# EAGLE design Thermostat (EAGLE 9.6.2)
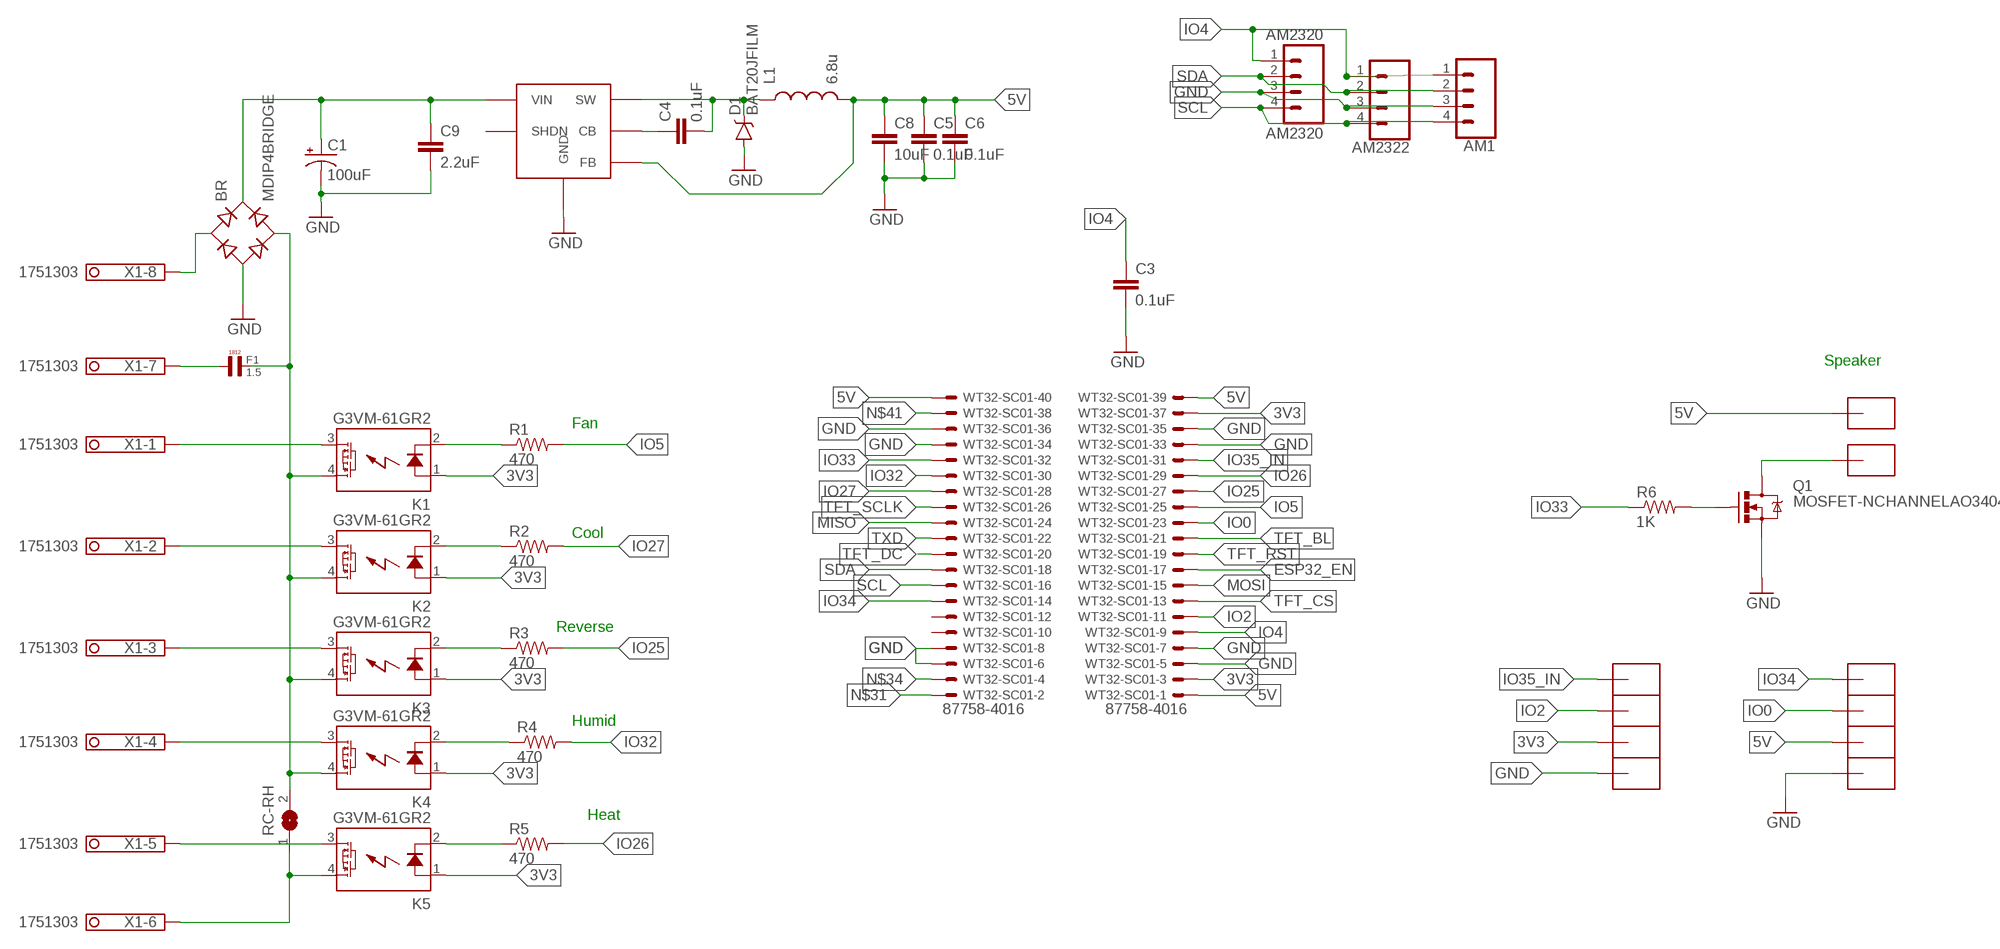
[diagram p0: schematic, sheet 1]

## Parts
AM1  CONN_041.27MM  [1X04_1.27MM]
AM2320  AM2320  M04PTH  [1X04]
AM2322  CONN_041.27MM  [1X04_1.27MM]
BR  MDIP4BRIDGE  [MICRODIP4]
C1  100uF  CAP_POLC  [PANASONIC_C]
C3  0.1uF  CAP0805  [0805]
C4  0.1uF  CAP0805  [0805]
C5  0.1uF  CAP0805  [0805]
C6  0.1uF  CAP0805  [0805]
C8  10uF  CAP0805  [0805]
C9  2.2uF  CAP0805  [0805]
D1  BAT20JFILM  [SOD-323]
F1  1.5  0,1µF  [L4,8]
K1  G3VM-61GR2  AQY22SOP  [SOP04]
K2  G3VM-61GR2  AQY22SOP  [SOP04]
K3  G3VM-61GR2  AQY22SOP  [SOP04]
K4  G3VM-61GR2  AQY22SOP  [SOP04]
K5  G3VM-61GR2  AQY22SOP  [SOP04]
L1  6.8u  INDUCTOR1007  [1007]
Q1  MOSFET-NCHANNELAO3404A  [SOT23-3]
R1  470  RESISTOR0805-RES  [0805]
R2  470  RESISTOR0805-RES  [0805]
R3  470  RESISTOR0805-RES  [0805]
R4  470  RESISTOR0805-RES  [0805]
R5  470  RESISTOR0805-RES  [0805]
R6  1K  RESISTOR0805-RES  [0805]
RC-RH  SJ  [SJ]
U$1  SMD-PAD1SMD-PAD80X32  [SMD-PAD6]
U$2  SMD-PAD1SMD-PAD80X32  [SMD-PAD6]
U$3  SMD-PAD1SMD-PAD80X32  [SMD-PAD6]
U$4  SMD-PAD1SMD-PAD80X32  [SMD-PAD6]
U$5  SMD-PAD1SMD-PAD80X32  [SMD-PAD6]
U$6  SMD-PAD1SMD-PAD80X32  [SMD-PAD6]
U$7  SMD-PAD1SMD-PAD80X32  [SMD-PAD6]
U$9  SMD-PAD1SMD-PAD80X32  [SMD-PAD6]
U$10  SMD-PAD1SMD-PAD80X32  [SMD-PAD6]
U$11  SMD-PAD1SMD-PAD80X32  [SMD-PAD6]
VREG  LMR16006YQ  [SOT-23-6]
WT32-SC01  87758-4016  [87758-4016]
X1  1751303  [1751303]

## Nets
3V3: K1.1(A) K2.1(A) K3.1(A) K4.1(A) K5.1(A) U$1.>PAD WT32-SC01.3 WT32-SC01.37
5V: C5.1 C6.1 C8.1 L1.2 U$5.>PAD U$7.>PAD VREG.3(FB) WT32-SC01.1 WT32-SC01.39 WT32-SC01.40
ESP32_EN: WT32-SC01.17
GND: AM1.3 AM2320.3 AM2322.3 BR.- C1.- C3.2 C5.2 C6.2 C8.2 C9.2 D1.A Q1.2(S) U$2.>PAD U$9.>PAD VREG.2(GND) WT32-SC01.5 WT32-SC01.6 WT32-SC01.7 WT32-SC01.8 WT32-SC01.33 WT32-SC01.34 WT32-SC01.35 WT32-SC01.36
IO0: U$10.>PAD WT32-SC01.23
IO2: U$3.>PAD WT32-SC01.11
IO4: AM1.1 AM2320.1 AM2322.1 C3.1 WT32-SC01.9
IO5: R1.2 WT32-SC01.25
IO25: R3.2 WT32-SC01.27
IO26: R5.2 WT32-SC01.29
IO27: R2.2 WT32-SC01.28
IO32: R4.2 WT32-SC01.30
IO33: R6.1 WT32-SC01.32
IO34: U$6.>PAD WT32-SC01.14
IO35_IN: U$4.>PAD WT32-SC01.31
MISO: WT32-SC01.24
MOSI: WT32-SC01.15
N$2: C4.2 D1.C L1.1 VREG.6(SW)
N$3: BR.AC2 F1.P$2 K1.4(DS1) K2.4(DS1) K3.4(DS1) K4.4(DS1) RC-RH.2
N$4: K4.2(K) R4.1
N$6: Q1.1(G) R6.2
N$7: K3.2(K) R3.1
N$10: K2.2(K) R2.1
N$11: K4.3(DS2) X1.4
N$13: K2.3(DS2) X1.2
N$15: K1.3(DS2) X1.1
N$16: K1.2(K) R1.1
N$17: C4.1 VREG.1(CB)
N$18: K5.3(DS2) X1.5
N$20: BR.AC1 X1.8
N$22: K5.4(DS1) RC-RH.1 X1.6
N$23: F1.P$1 X1.7
N$24: BR.+ C1.+ C9.1 VREG.5(VIN)
N$25: K5.2(K) R5.1
N$29: K3.3(DS2) X1.3
N$31: WT32-SC01.2
N$34: WT32-SC01.4
N$39: Q1.3(D) U$11.>PAD
N$41: WT32-SC01.38
SCL: AM1.4 AM2320.4 AM2322.4 WT32-SC01.16
SDA: AM1.2 AM2320.2 AM2322.2 WT32-SC01.18
TFT_BL: WT32-SC01.21
TFT_CS: WT32-SC01.13
TFT_DC: WT32-SC01.20
TFT_RST: WT32-SC01.19
TFT_SCLK: WT32-SC01.26
TXD: WT32-SC01.22
Unconnected: VREG.4(SHDN) WT32-SC01.10 WT32-SC01.12

## Notes on the sheet
- Speaker
- Fan
- Cool
- Reverse
- Humid
- Heat

## Library data of the parts
AM1 AM2322 = SparkFun-Connectors:CONN_04: Multi connection point. Often used as Generic Header-pin footprint for 0.1 inch spaced/style header connections On any of the 0.1 inch spaced packages, you can populate with these: Break Away Headers - Straight <https://www.sparkfun.com/products/116> (PRT-00116) Break Away Male Headers - Right Angle <https://www.sparkfun.com/products/553> (PRT-00553) Female Headers <https://www.sparkfun.com/products/115> (PRT-00115) Break Away Headers - Machine Pin <https://www.sparkfun.com/products/117> (PRT-00117) Break Away Female Headers - Swiss Machine Pin <https://www.sparkfun.com/products/743> (PRT-00743) For SCREWTERMINALS and SPRING TERMINALS visit here: Screw Terimnals on SparkFun.com <https://www.sparkfun.com/search/results?term=Screw+Terminals> (5mm/3.5mm/2.54mm spacing) This device is also useful as a general connection point to wire up your design to another part of your project. Our various solder wires solder well into these plated through hole pads. Hook-Up Wire - Assortment (Stranded, 22 AWG) <https://www.sparkfun.com/products/11375> (PRT-11375) Hook-Up Wire - Assortment (Solid Core, 22 AWG) <https://www.sparkfun.com/products/11367> (PRT-11367) View the entire wire category on our website here <https://www.sparkfun.com/categories/141> Special notes: Molex polarized connector foot print use with SKU : PRT-08231 with associated crimp pins and housings. 1MM SMD Version SKU: PRT-10208
AM2320 = SparkFun-Connectors:M04: Header 4 Standard 4-pin 0.1" header. Use with straight break away headers (SKU : PRT-00116), right angle break away headers (PRT-00553), swiss pins (PRT-00743), machine pins (PRT-00117), and female headers (PRT-00115). Molex polarized connector foot print use with SKU : PRT-08231 with associated crimp pins and housings. 1MM SMD Version SKU: PRT-10208; PROD_ID: CONN-09696
BR = CuriousTech:MDIP4BRIDGE
C1 = SparkFun-Capacitors:CAP_POL: Capacitor Polarized These are standard SMD and PTH capacitors. Normally 10uF, 47uF, and 100uF in electrolytic and tantalum varieties. Always verify the external diameter of the through hole cap, it varies with capacity, voltage, and manufacturer. The EIA devices should be standard.
C3-C6 C8 C9 = SparkFun-Capacitors:CAP: Capacitor Standard 0603 ceramic capacitor, and 0.1" leaded capacitor.
D1 = SparkFun-DiscreteSemi:BAT20JFILM: 23V, 1A Schottky diode, SOD-323 package; PROD_ID: DIO-11623
F1 = Capacitor-Wima-SMD1812-100v:0,1µF
K1-K5 = relay:AQY*: PhotoMOS Relay NAiS Source: http://www.panasonic-electric-works.com/catalogues/downloads/photomos/ds_x615_en_aqz10_20.pdf; OC_FARNELL: unknown; OC_NEWARK: unknown
L1 = SparkFun-Passives:INDUCTOR: Inductors Basic Inductor/Choke - 0603 and 1206. Footprints are not proven and vary greatly between part numbers. INDUCTOR POWER 3.3UH 4.0A SMD 0.197" L x 0.197" W x 0.177" H (5.00mm x 5.00mm x 4.50mm)
Q1 = SparkFun-DiscreteSemi:MOSFET-NCHANNEL: Common NMOSFET Parts MFG P/N Store ID Prod ID FDD8780 TRANS-09984 SI7820DN TRANS-11055 FDS6630A IC-08089 2N7002PW TRANS-11151 FQP30N06L COM-10213 TRANS-10060 BSS123LT1G TRANS-08345 BSS138 TRANS-00830 BS170 2N7000; PROD_ID: TRAN-12988
R1-R5 = SparkFun-Passives:RESISTOR: Resistor Basic schematic elements and footprints for 0603, 1206, and PTH resistors.
R6 = SparkFun-Resistors:RESISTOR: Resistor Basic schematic elements and footprints for 0603, 1206, and PTH resistors.
RC-RH = jumper:SJ: SMD solder JUMPER
U$1-U$7 U$9-U$11 = CuriousTech:SMD-PAD1: SMD-PAD small
VREG = CuriousTech:LMR16006YQ
WT32-SC01 = con-molex:87758-4016: 40 Pin - 2mm Dual Row Single Wafer, Vertical T/H HDR Source: http://www.molex.com/pdm_docs/sd/877580616_sd.pdf; MF: MOLEX; MPN: 87758-4016; OC_FARNELL: unknown; OC_NEWARK: 25M5691
X1 = con-phoenix-350:1751303: MKDS 1/ 8-3,5 Printklemme Nennstrom: 10 A Bemessungsspannung: 160 V Raster: 3,5 mm Polzahl: 8 Montageart: Löten Anschlussart: Schraubanschluss Anschlussrichtung vom Leiter zur Platine: 0° Source: http://eshop.phoenixcontact.com .. .pdf; OC_FARNELL: unknown; OC_NEWARK: unknown

## Board
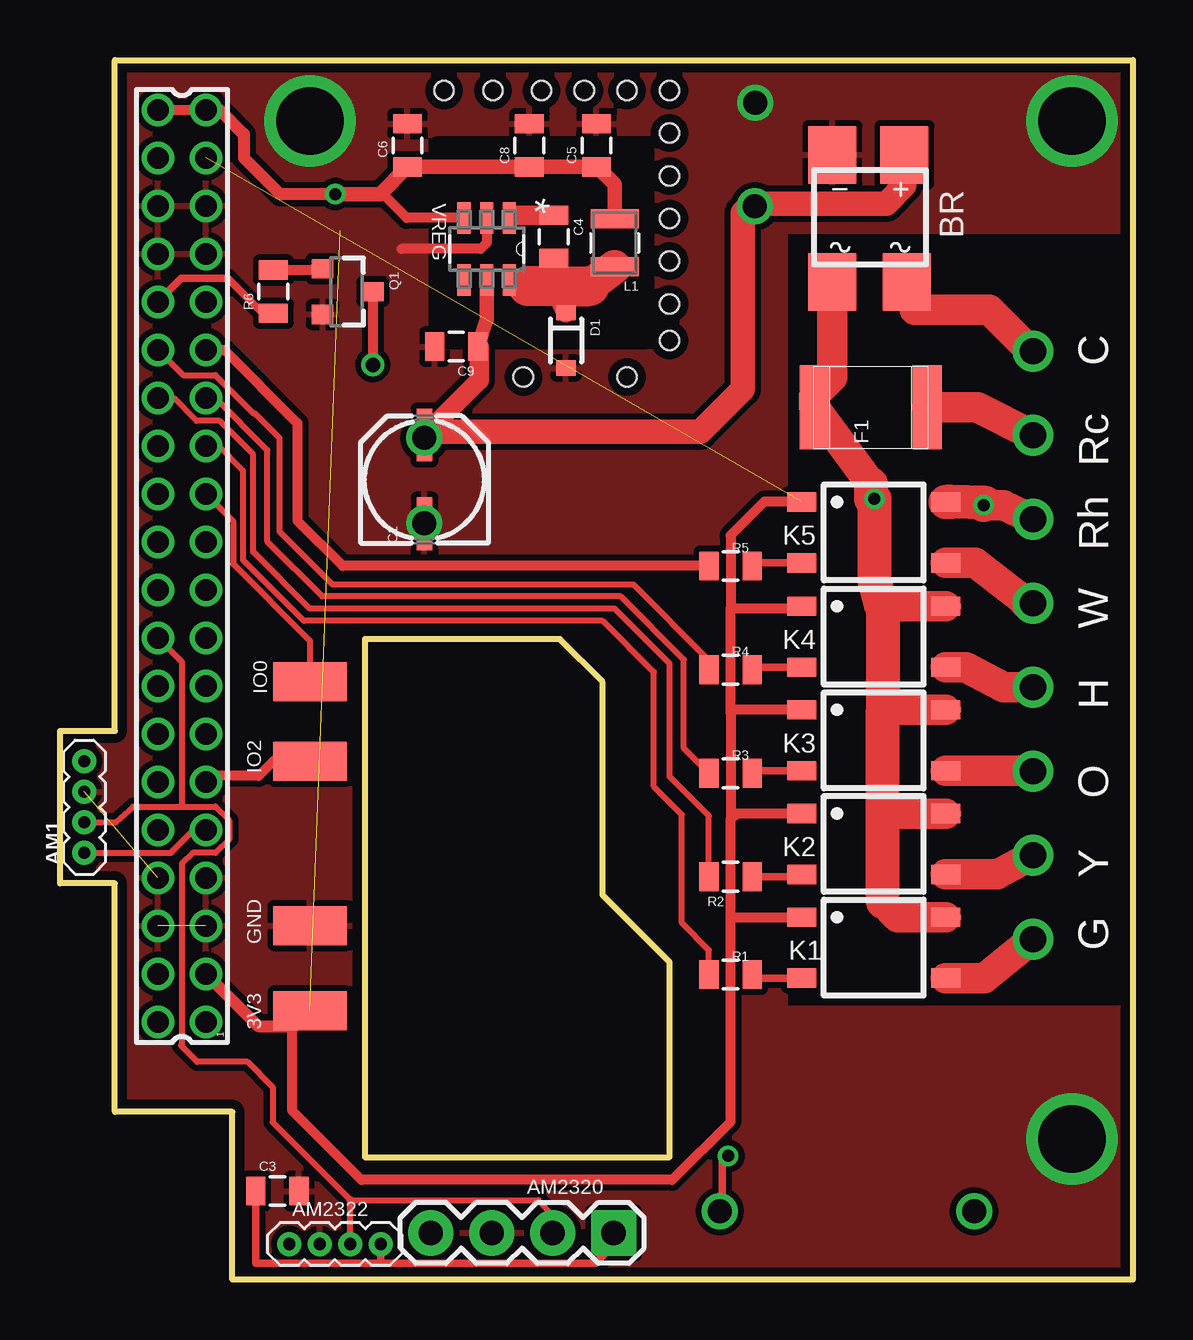
[diagram p1: board, top side]
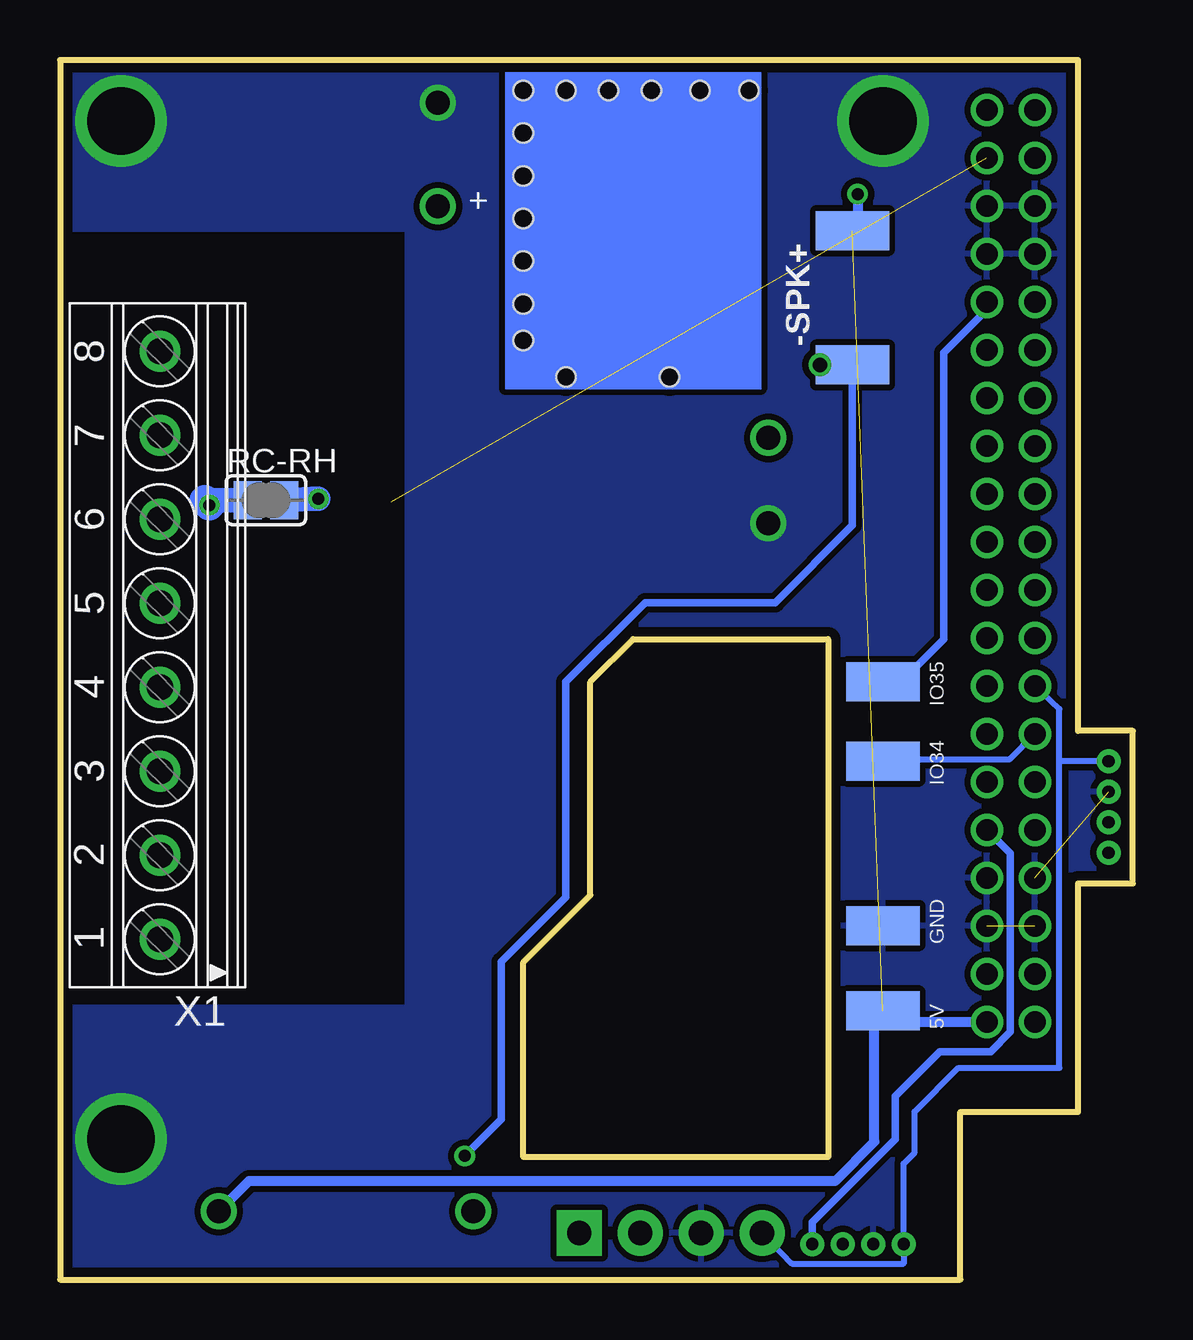
[diagram p2: board, bottom side, seen from below]

Size 44.7 x 50.81 mm. Coordinates in mm from the lower left corner, seen from the top.
Outline: 44.7,0 7.19,0 7.19,6.98 2.29,6.98 2.29,16.51 0,16.51 0,22.86 2.29,22.86 2.29,50.81 44.7,50.81 44.7,0
Outline: 12.7,26.68 12.7,5.1 25.4,5.1 25.4,13.22 22.61,16.02 22.61,24.91 20.83,26.68 12.7,26.68
Copper layers (1*16): Top 0.0356mm / dielectric 1.5011mm / Bottom 0.0356mm
Design rules "LaenPCBOrder": minimum track width 6mil, minimum drill 13mil, track to track 6mil, track to pad 6mil, pad to pad 6mil, via to via 6mil, smd to smd 6mil, copper to edge 15mil, drill to drill 6mil, minimum pad ring 7mil, minimum via ring 7mil, stop-mask expansion 4mil, vias tented up to drill 0mil, thermal gap 10mil
Holes 0.8 mm at 20.07,49.54 21.84,49.54 23.62,49.54 25.4,49.54 25.4,47.77 25.4,45.99 25.4,44.21 25.4,42.43 25.4,40.65 25.4,39.13 23.62,37.61 19.3,37.61 18.03,49.54 16,49.54
tRestrict: area 15.7,39.1 to 24.4,47.3

### Footprints (pad centres in the part's own frame; a part is rotated, then mirrored left to right if it is on the bottom)
1X04_1.27MM = drill 0.508 pad 1: 1 0,0; 2 1.27,0; 3 2.54,0; 4 3.81,0
1X04 = drill 1.016 pad 1.88 square: 1 0,0 | drill 1.016 pad 1.88: 2 2.54,0; 3 5.08,0; 4 7.62,0
MICRODIP4 = smd 2 x 2.4: + -1.4,-2.65; - 1.6,-2.65; AC1 -1.5,2.65; AC2 1.6,2.65
PANASONIC_C = smd 2.2 x 0.65: + 1.9,-0.2; - -1.8,-0.2
0805 = smd 0.8 x 1.2: 1 -0.9,0; 2 0.9,0
SOD-323 = smd 0.63 x 0.83: A 1.15,0; C -1.15,0
L4,8 = smd 3.5 x 1.2: P$1 0,-2.35; P$2 0,2.35
SOP04 = smd 0.8 x 1.2: 1 -1.27,-3; 2 1.27,-3; 3 1.27,3; 4 -1.27,3
1007 = smd 2 x 0.8: 1 0,1; 2 0,-1
SOT23-3 = smd 0.8 x 0.9: 1 -0.95,-1; 2 0.95,-1; 3 0,1.1
SJ = smd 1.168 x 1.6: 1 -0.762,0; 2 0.762,0
SMD-PAD6 = smd 3.048 x 1.626: >PAD 0,0
SOT-23-6 = smd 1.321 x 0.559: 1 -1.295,0.94; 2 -1.295,0; 3 -1.295,-0.94; 4 1.295,-0.94; 5 1.295,0; 6 1.295,0.94
87758-4016 = drill 0.9 pad 1.27: 1 -19,-1; 2 -19,1; 3 -17,-1; 4 -17,1; 5 -15,-1; 6 -15,1; 7 -13,-1; 8 -13,1; 9 -11,-1; 10 -11,1; 11 -9,-1; 12 -9,1; 13 -7,-1; 14 -7,1; 15 -5,-1; 16 -5,1; 17 -3,-1; 18 -3,1; 19 -1,-1; 20 -1,1; 21 1,-1; 22 1,1; 23 3,-1; 24 3,1; 25 5,-1; 26 5,1; 27 7,-1; 28 7,1; 29 9,-1; 30 9,1; 31 11,-1; 32 11,1; 33 13,-1; 34 13,1; 35 15,-1; 36 15,1; 37 17,-1; 38 17,1; 39 19,-1; 40 19,1
1751303 = drill 1.1 pad 1.7: 1 -12.25,-0.1; 2 -8.75,-0.1; 3 -5.25,-0.1; 4 -1.75,-0.1; 5 1.75,-0.1; 6 5.25,-0.1; 7 8.75,-0.1; 8 12.25,-0.1

### Placement (x,y rotation side)
AM1  1.02,17.78 90 top
AM2320  23.07,1.94 180 top
AM2322  13.36,1.48 180 top
BR  33.78,44.21 180 top
C1  14.99,33.29 90 top
C3  9.06,3.69 0 top
C4  20.57,43.45 270 top
C5  22.35,47.26 90 top
C6  14.48,47.26 90 top
C8  19.56,47.26 90 top
C9  16.51,38.88 180 top
D1  21.08,39.13 270 top
F1  33.78,36.34 90 top
K1  33.9,13.83 270 top
K2  33.9,18.15 270 top
K3  33.9,22.47 270 top
K4  33.9,26.78 270 top
K5  33.9,31.13 270 top
L1  23.11,43.19 180 top
Q1  11.94,41.16 270 top
R1  27.94,12.71 180 top
R2  27.94,16.78 180 top
R3  27.94,21.1 180 top
R4  27.94,25.41 180 top
R5  27.94,29.73 180 top
R6  8.89,41.16 90 top
RC-RH  36.12,32.47 0 bottom
U$1  10.41,11.19 0 top
U$2  10.41,14.75 0 bottom
U$3  10.41,21.6 0 top
U$4  10.41,24.91 0 bottom
U$5  11.68,43.7 0 bottom
U$6  10.41,21.6 0 bottom
U$7  10.41,11.19 0 bottom
U$9  10.41,14.75 0 top
U$10  10.41,24.91 0 top
U$11  11.68,38.11 180 bottom
VREG  17.78,42.94 270 top
WT32-SC01  5.08,29.73 90 top
X1  40.64,26.43 90 bottom

### Tracks (layer width: path | path; a pad name or v marks a point on that pad's centre or on a via)
3V3  (1 unrouted)
  Top 0.305: 27.94,15 28,15.06 28,15.1
  Top 0.406: 28,15.1 K1.1 | 27.94,19.2 27.94,15 27.94,6.58 25.51,4.15 12.56,4.15 9.68,7.03 9.68,10.56 9.78,10.56 U$1.>PAD | 27.94,19.2 28.24,19.42 K2.1 | 27.94,23.64 27.94,19.2 | K4.1 30.8,27.95 27.94,27.95 | K5.1 30.89,32.41 29.35,32.41 27.94,31 27.94,27.95 | K3.1 28.04,23.74 27.94,23.64 | 27.94,23.64 27.94,27.95
  Top 0.508: WT32-SC01.3 8.26,10.56 9.78,10.56
5V  (via drill 0.5, 1)  (1 unrouted)
  Top 0.305: C6.1 14.41,46.36 13.37,45.31
  Top 0.406: C5.1 | C5.1 22.37,46.37 | C5.1 | WT32-SC01.40 WT32-SC01.39 | L1.2 23.12,44.19 | VREG.3 14.45,44.23 | 14.44,44.23 14.45,44.23 | 14.45,44.23 13.37,45.31 | C8.1
  Top 0.508: WT32-SC01.39 6.65,48.73 7.66,47.73 7.66,46.75 9.18,45.23 v11.47,45.23
  Top 0.61: 23.12,44.19 23.12,45.63 22.37,46.37 | C5.1 C8.1 C6.1 13.35,45.23 v11.47,45.23
  Bottom 0.305: 10.77,10.83 U$7.>PAD
  Bottom 0.406: 11.94,43.7 U$5.>PAD 11.47,43.92 v11.47,45.23 11.43,45.23 | U$7.>PAD 9.96,10.73 WT32-SC01.1 | 10.77,10.83 10.77,5.75 12.41,4.11 36.83,4.11 v38.09,2.85
GND  (via drill 1, 2.8)  (2 unrouted)
  Top 0.406: 17.78,43.7 VREG.2 17.78,43.19 17.53,42.94 14.22,42.94
  other vias: 15.19,31.51 10.41,48.27 42.16,48.27 42.16,5.86 28.96,49.04
  pour Top (isolate 0.254): 0,1.02 1.02,0 44.7,0 44.7,11.27 30.23,11.27 30.23,43.7 44.7,43.7 44.7,50.81 0,50.81
  pour Bottom (isolate 0.254): 44.7,43.78 30.23,43.78 30.23,11.33 44.7,11.33 44.7,0 0.2,0 0,0.19 0,50.81 44.7,50.81
IO0
  Top 0.254: WT32-SC01.23 7.21,31.6 7.21,29.82 10.41,26.62 U$10.>PAD
IO2
  Top 0.406: U$3.>PAD 8.89,21.6 8.27,20.99 6.33,20.99 WT32-SC01.11
IO4
  Top 0.254: AM1.1 3.68,17.78 3.69,17.78 4.62,17.78 5.57,18.73 WT32-SC01.9
  Top 0.305: AM2320.1 23.07,1.46 22.3,0.69 13.36,0.69 AM2322.1 13.36,0.72 13.32,0.67 8.16,0.67 8.16,3.38 C3.1
  Bottom 0.305: WT32-SC01.9 5.1,17.75 5.1,10.33 5.93,9.5 8.05,9.5 9.91,7.64 9.91,5.84 13.36,2.39 AM2322.1
IO5
  Top 0.254: R1.2 27.04,13.73 25.91,14.86 25.91,19.37 24.74,20.54 24.74,25.31 22.61,27.45 10.16,27.45 7.62,29.99 7.62,33.7 6.59,34.73 WT32-SC01.25
IO25
  Top 0.254: R3.2 26,22.14 26,25.83 23.37,28.46 10.92,28.46 8.64,30.75 8.64,34.56 6.46,36.73 WT32-SC01.27
IO26
  Top 0.406: R5.2 11.78,29.73 9.89,31.62 9.89,35.68 6.84,38.73 WT32-SC01.29
IO27
  Top 0.254: R2.2 27.04,19.32 25.4,20.96 25.4,25.67 23.11,27.95 10.41,27.95 8.05,30.32 8.05,34.38 6.65,35.78 5.68,35.78 4.73,36.73 WT32-SC01.28
IO32
  Top 0.254: WT32-SC01.30 5.13,37.69 6.47,37.69 8.08,36.08 8.13,36.08 9.14,35.07 9.14,31.18 11.35,28.97 23.88,28.97 27.04,25.81 R4.2
IO33
  Top 0.305: R6.1 8.44,40.26 6.99,41.71 5.06,41.71 WT32-SC01.32
IO34
  Bottom 0.254: U$6.>PAD 10.33,21.69 5.13,21.69 WT32-SC01.14
IO35_IN
  Bottom 0.305: U$4.>PAD 9.65,24.91 7.87,26.68 7.87,38.62 6.08,40.42 WT32-SC01.31
N$2
  Top 0.61: 19.5,41.39 19.48,41.65 VREG.6
  Top 0.813: D1.C 20.57,41.39 C4.2
  Top 1.422: 22.06,41.39 L1.1
  Top 1.676: 22.06,41.39 20.57,41.39 19.5,41.39
N$3  (via drill 0.5)
  Top 0.406: 34.29,28.05 34.19,28.15
  Top 1.27: K3.4 34.29,23.74 | K1.4 34.9,15.1 34.29,15.74 | K2.4 34.29,19.42 | K4.4 34.29,28.05 | 33.78,33.15 F1.P$2 31.43,36.84 32.18,37.59 BR.AC2 | BR.AC2
  Top 1.422: 34.29,15.74 34.29,19.42 34.29,23.74 34.29,28.05 | 33.78,33.15 33.78,32.53 v33.94,32.53 33.94,29.18 34.19,28.15
  Bottom 1.016: RC-RH.2 34.19,32.53 v33.94,32.53
N$4
  Top 0.305: K4.2 28.95,25.51 R4.1
N$6
  Top 0.406: Q1.1 11.15,41.91 10.84,42.25 10.46,42.06 R6.2
N$7
  Top 0.305: K3.2 28.95,21.2 R3.1
N$10
  Top 0.305: R2.1 30.8,16.78 K2.2
N$11
  Top 1.27: K4.3 37.75,25.51 39.32,24.68 X1.4
N$13
  Top 1.27: X1.2 39.05,16.88 K2.3
N$15
  Top 1.27: K1.3 38.51,12.56 40.5,14.18 X1.1
N$16
  Top 0.305: R1.1 28.97,12.71 29.12,12.56 K1.2
N$17
  Top 0.406: VREG.1 18.83,44.35
  Top 0.813: 18.83,44.35 C4.1
N$18
  Top 1.27: K5.3 38.13,29.86 40.18,28.28 40.22,28.18 X1.5
N$20
  Top 1.27: X1.8 40.45,38.68 38.72,40.41 35.61,40.41 BR.AC1
N$22  (via drill 0.5)
  Top 1.27: v38.48,32.27 39.3,32.27 X1.6
  Top 1.422: K5.4 37.15,32.4 38.57,32.36 v38.48,32.27
  Bottom 1.016: RC-RH.1 38.68,32.47
  Bottom 1.27: 38.68,32.47 v38.48,32.27
N$23
  Top 1.27: X1.7 38.23,36.34 F1.P$1
N$24  (via drill 1)
  Top 0.406: v15.19,35.07 15.24,35.13 C1.+
  Top 0.61: C9.1 17.78,40.01 VREG.5
  Top 0.813: C1.+ 17.48,37.48 17.48,38.84 17.43,38.88 C9.1
  Top 1.016: BR.+ 35.18,45.59 34.42,44.83 29.12,44.83 28.98,44.7 v28.96,44.72 28.94,44.7 28.72,44.7 28.45,44.44 28.45,37.1 26.67,35.32 15.65,35.32 15.54,35.2 C1.+
N$25
  Top 0.305: K5.2 28.98,29.86 R5.1
N$29
  Top 1.27: K3.3 40.54,21.2 X1.3
N$39  (via drill 0.5, 0.6, 1)
  Top 0.305: v27.84,5.15 27.59,4.9 27.59,3.24 27.49,3.14 v27.49,2.85
  Top 0.406: Q1.3 v13.04,38.11
  Bottom 0.305: v27.84,5.15 26.31,6.68 26.31,13.24 23.62,15.93 23.62,24.91 20.32,28.21 14.9,28.21 11.68,31.43 U$11.>PAD
  Bottom 0.406: U$11.>PAD v13.04,38.11
SCL
  Bottom 0.254: 3.06,21.59 3.06,8.82 7.27,8.82 9.09,6.99 9.09,5.29 9.55,4.83 AM2322.4 9.55,0.67 14.21,0.67 AM2320.4 | 3.06,21.59 3.06,23.78 WT32-SC01.16 | AM1.4 3.06,21.59
SDA
  Top 0.254: WT32-SC01.18 5.08,25.73 5.08,19.7 | AM2320.2 20.56,2.66 19.93,3.31 12.09,3.31 AM2322.2 | 12.09,3.33 8.86,6.56 8.86,8.02 7.81,9.07 5.72,9.07 5.03,9.75 5.08,9.8 5.08,17.34 5.52,17.78 6.47,17.78 7.04,18.34 7.04,19.13 6.47,19.7 5.08,19.7 | 5.08,19.7 3.04,19.7 2.32,19.05 AM1.2
  Top 0.305: 12.09,3.33 12.09,3.31
(copper drawn outside any net)
  shapes: Bottom area x1

### Text on the board
tPlace: C | Rc | Rh | W | H | O | Y | G
bPlace: +
tNames: IO0 | IO2 | GND | 3V3
bNames: -SPK+ | IO35 | IO34 | GND | 5V
bStop: CuriousTech.net | ESP32-HVAC